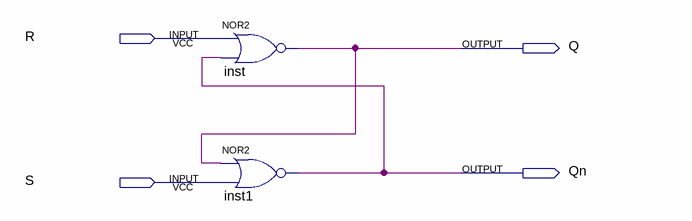
[diagram p0: schematic sheet]
// Quartus schematic s_r_latch.bdf as structural Verilog: 2 symbols, 4 pins
module s_r_latch (
  input  R,
  input  S,
  output Q,
  output Qn
);

  nor inst (Q, R, Qn);
  nor inst1 (Qn, Q, S);
endmodule
